# Altium schematic sheet GPO.SchDoc
size A4; SheetNumber: 7; SheetTotal: 8
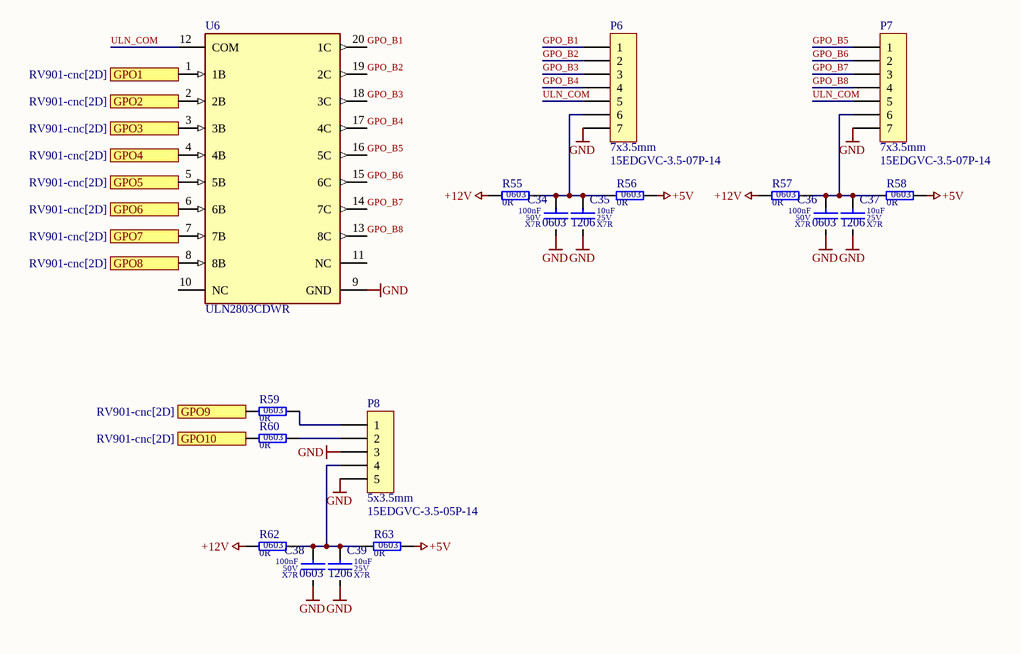
[diagram p0: GPO.SchDoc]

## Parts
C34  value 100nF  Dielectric: X7R  Voltage: 50V  SCH_Footprint: 0603  [C_0603_1608]  (hidden comment: Ceramic X7R)
C35  value 10uF  Dielectric: X7R  Voltage: 25V  SCH_Footprint: 1206  [C_1206_3216]  (hidden comment: Ceramic X7R)
C36  value 100nF  Dielectric: X7R  Voltage: 50V  SCH_Footprint: 0603  [C_0603_1608]  (hidden comment: Ceramic X7R)
C37  value 10uF  Dielectric: X7R  Voltage: 25V  SCH_Footprint: 1206  [C_1206_3216]  (hidden comment: Ceramic X7R)
C38  value 100nF  Dielectric: X7R  Voltage: 50V  SCH_Footprint: 0603  [C_0603_1608]  (hidden comment: Ceramic X7R)
C39  value 10uF  Dielectric: X7R  Voltage: 25V  SCH_Footprint: 1206  [C_1206_3216]  (hidden comment: Ceramic X7R)
P6  value 15EDGVC-3.5-07P-14  SCH_Footprint: 7x3.5mm  [P_15EDGVC-3.5-07P]  (hidden comment: 7-pin 3.5mm terminal block)
P7  value 15EDGVC-3.5-07P-14  SCH_Footprint: 7x3.5mm  [P_15EDGVC-3.5-07P]  (hidden comment: 7-pin 3.5mm terminal block)
P8  value 15EDGVC-3.5-05P-14  SCH_Footprint: 5x3.5mm  [P_15EDGVC-3.5-05P]  (hidden comment: 5-pin 3.5mm terminal block)
R55  value 0R  SCH_Footprint: 0603  [R_0603_1608]  (hidden comment: Resistor)
R56  value 0R  SCH_Footprint: 0603  [R_0603_1608]  (hidden comment: Resistor)
R57  value 0R  SCH_Footprint: 0603  [R_0603_1608]  (hidden comment: Resistor)
R58  value 0R  SCH_Footprint: 0603  [R_0603_1608]  (hidden comment: Resistor)
R59  value 0R  SCH_Footprint: 0603  [R_0603_1608]  (hidden comment: Resistor)
R60  value 0R  SCH_Footprint: 0603  [R_0603_1608]  (hidden comment: Resistor)
R62  value 0R  SCH_Footprint: 0603  [R_0603_1608]  (hidden comment: Resistor)
R63  value 0R  SCH_Footprint: 0603  [R_0603_1608]  (hidden comment: Resistor)
U6  ULN2803CDWR  [FP-DW0020A-MFG]

## Ports
GPO1 (in, see RV901-cnc[2D]), GPO2 (in, see RV901-cnc[2D]), GPO3 (in, see RV901-cnc[2D]), GPO4 (in, see RV901-cnc[2D]), GPO5 (in, see RV901-cnc[2D]), GPO6 (in, see RV901-cnc[2D]), GPO7 (in, see RV901-cnc[2D]), GPO8 (in, see RV901-cnc[2D]), GPO9 (in, see RV901-cnc[2D]), GPO10 (in, see RV901-cnc[2D])

## Nets
+5V: R56.2 R58.2 R63.2
+12V: R55.1 R57.1 R62.1
GND: C34.2 C35.2 C36.2 C37.2 C38.2 C39.2 P6.7 P7.7 P8.3 P8.5 U6.9(GND)
GPO1: U6.1(1B) ; port GPO1
GPO2: U6.2(2B) ; port GPO2
GPO3: U6.3(3B) ; port GPO3
GPO4: U6.4(4B) ; port GPO4
GPO5: U6.5(5B) ; port GPO5
GPO6: U6.6(6B) ; port GPO6
GPO7: U6.7(7B) ; port GPO7
GPO8: U6.8(8B) ; port GPO8
GPO9: R59.1 ; port GPO9
GPO10: R60.1 ; port GPO10
GPO_B1: P6.1 U6.20(1C)
GPO_B2: P6.2 U6.19(2C)
GPO_B3: P6.3 U6.18(3C)
GPO_B4: P6.4 U6.17(4C)
GPO_B5: P7.1 U6.16(5C)
GPO_B6: P7.2 U6.15(6C)
GPO_B7: P7.3 U6.14(7C)
GPO_B8: P7.4 U6.13(8C)
ULN_COM: P6.5 P7.5 U6.12(COM)
NetC34_1: C34.1 C35.1 P6.6 R55.2 R56.1
NetC36_1: C36.1 C37.1 P7.6 R57.2 R58.1
NetC38_1: C38.1 C39.1 P8.4 R62.2 R63.1
NetP8_1: P8.1 R59.2
NetP8_2: P8.2 R60.2

Not connected (* = marked no-connect by the designer): U6 10(NC) 11(NC)

## Library data of the parts
C34 C36 C38 = C_100nF_50V_X7R_0603_5: Capacitor; Manufacturer: Samsung; Manufacturer Part Number: CL10B104JB8NNNC; Tolerance (%): 5; Part Number: C_100nF_50V_X7R_0603_5; HelpURL: http://www.tme.eu/pl/Document/4a42202b32dab16128fe107dd69598cc/samsung-chip-cap.pdf; Supplier 1: TME; Supplier Part Number 1: CL10B104JB8NNNC; Supplier 2: RS Components; Supplier Part Number 2: 7665455; Supplier 3: Farnell; Supplier 4: Mouser; Supplier 5: Digi-Key; Supplier Part Number 5: 1276-1033-1-ND; Supplier 6: LCSC; Supplier Part Number 6: C24452
C35 C37 C39 = C_10uF_25V_X7R_1206_10: Capacitor; Manufacturer: Samsung; Manufacturer Part Number: CL31B106KAHNNNE; Tolerance (%): 10; Part Number: C_10uF_25V_X7R_1206_10; HelpURL: http://www.tme.eu/pl/Document/4a42202b32dab16128fe107dd69598cc/samsung-chip-cap.pdf; Supplier 1: TME; Supplier Part Number 1: CL31B106KAHNNNE; Supplier 2: RS Components; Supplier Part Number 2: 766-6773; Supplier 3: Farnell; Supplier Part Number 3: 3013526; Supplier 4: Mouser; Supplier Part Number 4: 187-CL31B106KAHNNNE; Supplier 5: Digi-Key; Supplier Part Number 5: 1276-1804-1-ND; Supplier 6: LCSC
P6 P7 = P_15EDGVC-3.5-07P-14: Pin Header; Manufacturer: DEGSON ELECTRONICS; Part Number: P_15EDGVC-3.5-07P-14; HelpURL: https://www.tme.eu/Document/83e7173fe653a2d0e44585e87978945b/opr014R8.pdf; Manufacturer Part Number: 15EDGVC-3.5-07P-14; Supplier 1: TME; Supplier 2: RS Components; Supplier 3: Farnell; Supplier 4: Mouser; Supplier 5: Digi-Key; Supplier 6: LCSC; Supplier Part Number 6: C5188323; Supplier 7: Conrad; Supplier Part Number 7: 1632093
P8 = P_15EDGVC-3.5-05P-14: Pin Header; Manufacturer: DEGSON ELECTRONICS; Part Number: P_15EDGVC-3.5-05P-14; HelpURL: https://www.tme.eu/Document/83e7173fe653a2d0e44585e87978945b/opr014R8.pdf; Manufacturer Part Number: 15EDGVC-3.5-05P-14; Supplier 1: TME; Supplier 2: RS Components; Supplier 3: Farnell; Supplier 4: Mouser; Supplier 5: Digi-Key; Supplier 6: LCSC; Supplier Part Number 6: C7603430; Supplier 7: Conrad; Supplier Part Number 7: 1327356
R55-R60 R62 R63 = R_0R_0603_1: Manufacturer: Yageo; Manufacturer Part Number: RC0603FR-070RL; Voltage: 75V; Power: 100mW; Tolerance: 1%; Part Number: R_0R_0603_1; HelpURL: https://datasheet.octopart.com/RC0603FR-070RL-Yageo-datasheet-8328172.pdf; Supplier 1: TME; Supplier Part Number 1: RC0603FR-070RL; Supplier 2: RS Components; Supplier 3: Farnell; Supplier Part Number 3: 2309106; Supplier 4: Mouser; Supplier Part Number 4: 603-RC0603FR-070RL; Supplier 5: Digi-Key; Supplier Part Number 5: 311-0.0HRCT-ND; Supplier 6: LCSC; Supplier Part Number 6: C100044
U6 = CMP-04912-000113-1: 50-V, EIGHT-CHANNEL DARLINGTON A